# EAGLE design vds_topboard_revC (EAGLE 8.5.1)
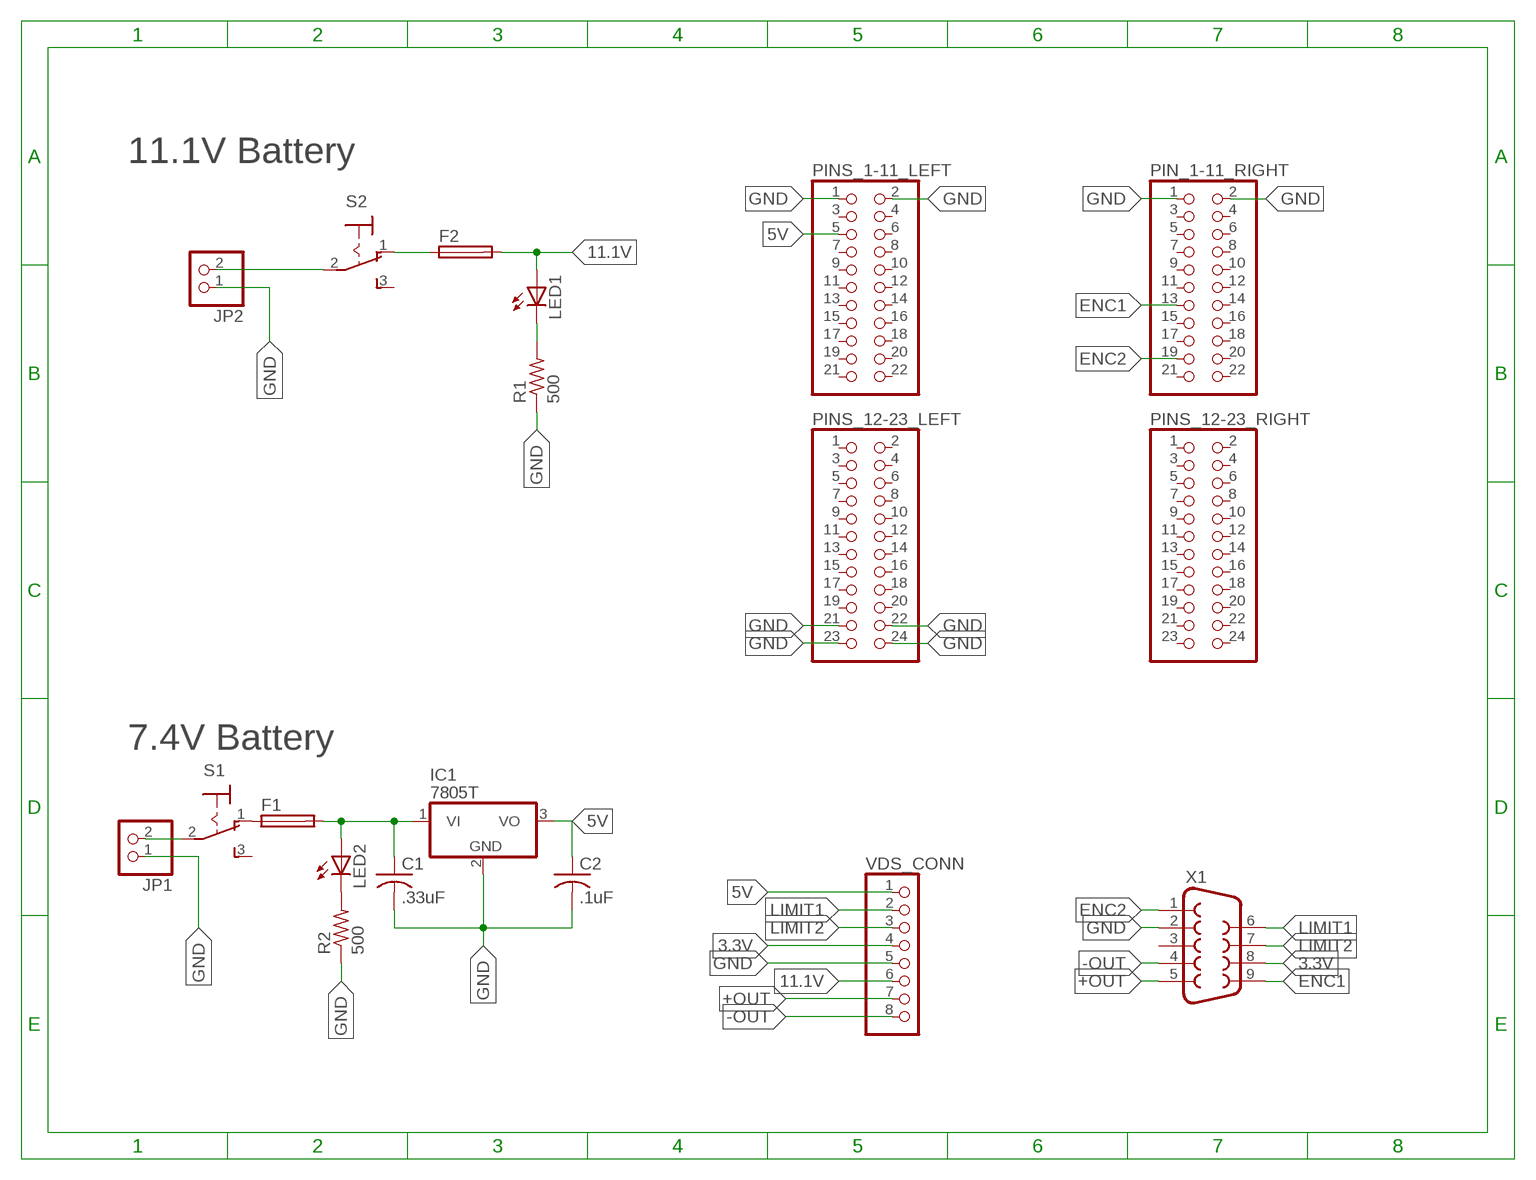
[diagram p0: schematic, sheet 1]

## Parts
C1  .33uF  C-US025-030X050  [C025-030X050]
C2  .1uF  C-US025-030X050  [C025-030X050]
F1  SH22,5  [SH22,5]
F2  SH22,5  [SH22,5]
IC1  7805T  [TO220H]
JP1  PINHD-1X2  [1X02]
JP2  PINHD-1X2  [1X02]
LED1  LED5MM  [LED5MM]
LED2  LED5MM  [LED5MM]
PIN_1-11_RIGHT  PINHD-2X11  [2X11]
PINS_1-11_LEFT  PINHD-2X11  [2X11]
PINS_12-23_LEFT  PINHD-2X12  [2X12]
PINS_12-23_RIGHT  PINHD-2X12  [2X12]
R1  500  R-US_0204/5  [0204/5]
R2  500  R-US_0204/5  [0204/5]
S1  320-916  [320-916]
S2  320-916  [320-916]
VDS_CONN  PINHD-1X8  [1X08]
X1  F09VP  [F09VP]

## Nets
3.3V: VDS_CONN.4 X1.8
5V: C2.1 IC1.3(VO) PINS_1-11_LEFT.5 VDS_CONN.1
7.4VO: C1.1 F1.2 IC1.1(VI) LED2.A
11.1V: F2.2 LED1.A VDS_CONN.6
+OUT: VDS_CONN.7 X1.5
-OUT: VDS_CONN.8 X1.4
ENC1: PIN_1-11_RIGHT.13 X1.9
ENC2: PIN_1-11_RIGHT.19 X1.1
GND: C1.2 C2.2 IC1.2(GND) JP1.1 JP2.1 PIN_1-11_RIGHT.1 PIN_1-11_RIGHT.2 PINS_1-11_LEFT.1 PINS_1-11_LEFT.2 PINS_12-23_LEFT.21 PINS_12-23_LEFT.22 PINS_12-23_LEFT.23 PINS_12-23_LEFT.24 R1.1 R2.1 VDS_CONN.5 X1.2
LIMIT1: VDS_CONN.2 X1.6
LIMIT2: VDS_CONN.3 X1.7
N$1: JP1.2 S1.2(P)
N$2: JP2.2 S2.2(P)
N$4: F2.1 S2.1(O)
N$5: LED1.K(C) R1.2
N$6: LED2.K(C) R2.2
N$7: F1.1 S1.1(O)
Unconnected: PIN_1-11_RIGHT.3 PIN_1-11_RIGHT.4 PIN_1-11_RIGHT.5 PIN_1-11_RIGHT.6 PIN_1-11_RIGHT.7 PIN_1-11_RIGHT.8 PIN_1-11_RIGHT.9 PIN_1-11_RIGHT.10 PIN_1-11_RIGHT.11 PIN_1-11_RIGHT.12 PIN_1-11_RIGHT.14 PIN_1-11_RIGHT.15 PIN_1-11_RIGHT.16 PIN_1-11_RIGHT.17 PIN_1-11_RIGHT.18 PIN_1-11_RIGHT.20 PIN_1-11_RIGHT.21 PIN_1-11_RIGHT.22 PINS_1-11_LEFT.3 PINS_1-11_LEFT.4 PINS_1-11_LEFT.6 PINS_1-11_LEFT.7 PINS_1-11_LEFT.8 PINS_1-11_LEFT.9 PINS_1-11_LEFT.10 PINS_1-11_LEFT.11 PINS_1-11_LEFT.12 PINS_1-11_LEFT.13 PINS_1-11_LEFT.14 PINS_1-11_LEFT.15 PINS_1-11_LEFT.16 PINS_1-11_LEFT.17 PINS_1-11_LEFT.18 PINS_1-11_LEFT.19 PINS_1-11_LEFT.20 PINS_1-11_LEFT.21 PINS_1-11_LEFT.22 PINS_12-23_LEFT.1 PINS_12-23_LEFT.2 PINS_12-23_LEFT.3 PINS_12-23_LEFT.4 PINS_12-23_LEFT.5 PINS_12-23_LEFT.6 PINS_12-23_LEFT.7 PINS_12-23_LEFT.8 PINS_12-23_LEFT.9 PINS_12-23_LEFT.10 PINS_12-23_LEFT.11 PINS_12-23_LEFT.12 PINS_12-23_LEFT.13 PINS_12-23_LEFT.14 PINS_12-23_LEFT.15 PINS_12-23_LEFT.16 PINS_12-23_LEFT.17 PINS_12-23_LEFT.18 PINS_12-23_LEFT.19 PINS_12-23_LEFT.20 PINS_12-23_RIGHT.1 PINS_12-23_RIGHT.2 PINS_12-23_RIGHT.3 PINS_12-23_RIGHT.4 PINS_12-23_RIGHT.5 PINS_12-23_RIGHT.6 PINS_12-23_RIGHT.7 PINS_12-23_RIGHT.8 PINS_12-23_RIGHT.9 PINS_12-23_RIGHT.10 PINS_12-23_RIGHT.11 PINS_12-23_RIGHT.12 PINS_12-23_RIGHT.13 PINS_12-23_RIGHT.14 PINS_12-23_RIGHT.15 PINS_12-23_RIGHT.16 PINS_12-23_RIGHT.17 PINS_12-23_RIGHT.18 PINS_12-23_RIGHT.19 PINS_12-23_RIGHT.20 PINS_12-23_RIGHT.21 PINS_12-23_RIGHT.22 PINS_12-23_RIGHT.23 PINS_12-23_RIGHT.24 S1.3(S) S2.3(S) X1.3

## Notes on the sheet
- 11.1V Battery
- 7.4V Battery

## Library data of the parts
C1 C2 = adafruit:C-US: CAPACITOR, American symbol
F1 F2 = fuse:SH22,5: FUSE HOLDER grid 22,5 mm, OGN0031 8201, Schurter (Buerklin); MF: SCHURTER; MPN: 0031.8201; OC_FARNELL: 1162740; OC_NEWARK: 96F8317
IC1 = linear:78*: Positive VOLTAGE REGULATOR Source: http://cache.national.com/ds/LM/LM78L05.pdf http://www.fairchildsemi.com/ds/LM/LM7805.pdf
JP1 JP2 = pinhead:PINHD-1X2: PIN HEADER
LED1 LED2 = adafruit:LED: LED OSRAM: - CHIPLED LG R971, LG N971, LY N971, LG Q971, LY Q971, LO R971, LY R971 LH N974, LH R974 LS Q976, LO Q976, LY Q976 LO Q996 - Hyper CHIPLED LW Q18S LB Q993, LB Q99A, LB R99A - SideLED LS A670, LO A670, LY A670, LG A670, LP A670 LB A673, LV A673, LT A673, LW A673 LH A674 LY A675 LS A676, LA A676, LO A676, LY A676, LW A676 LS A679, LY A679, LG A679 - Hyper Micro SIDELED® LS Y876, LA Y876, LO Y876, LY Y876 LT Y87S - SmartLED LW L88C, LW L88S LB L89C, LB L89S, LG L890 LS L89K, LO L89K, LY L89K LS L896, LA L896, LO L896, LY L896 - TOPLED LS T670, LO T670, LY T670, LG T670, LP T670 LSG T670, LSP T670, LSY T670, LOP T670, LYG T670 LG T671, LOG T671, LSG T671 LB T673, LV T673, LT T673, LW T673 LH T674 LS T676, LA T676, LO T676, LY T676, LB T676, LH T676, LSB T676, LW T676 LB T67C, LV T67C, LT T67C, LS T67K, LO T67K, LY T67K, LW E67C LS E67B, LA E67B, LO E67B, LY E67B, LB E67C, LV E67C, LT E67C LW T67C LS T679, LY T679, LG T679 LS T770, LO T770, LY T770, LG T770, LP T770 LB T773, LV T773, LT T773, LW T773 LH T774 LS E675, LA E675, LY E675, LS T675 LS T776, LA T776, LO T776, LY T776, LB T776 LHGB T686 LT T68C, LB T68C - Hyper Mini TOPLED® LB M676 - Mini TOPLED Santana® LG M470 LS M47K, LO M47K, LY M47K Source: http://www.osram.convergy.de/
PIN_1-11_RIGHT PINS_1-11_LEFT = pinhead:PINHD-2X11: PIN HEADER
PINS_12-23_LEFT PINS_12-23_RIGHT = pinhead:PINHD-2X12: PIN HEADER
R1 R2 = adafruit:R-US_: RESISTOR, American symbol
S1 S2 = switch:320-916: TOGGLE SWITCH distributor RS Components
VDS_CONN = pinhead:PINHD-1X8: PIN HEADER
X1 = con-subd:F09: SUB-D; OC_FARNELL: unknown; OC_NEWARK: unknown

## Board
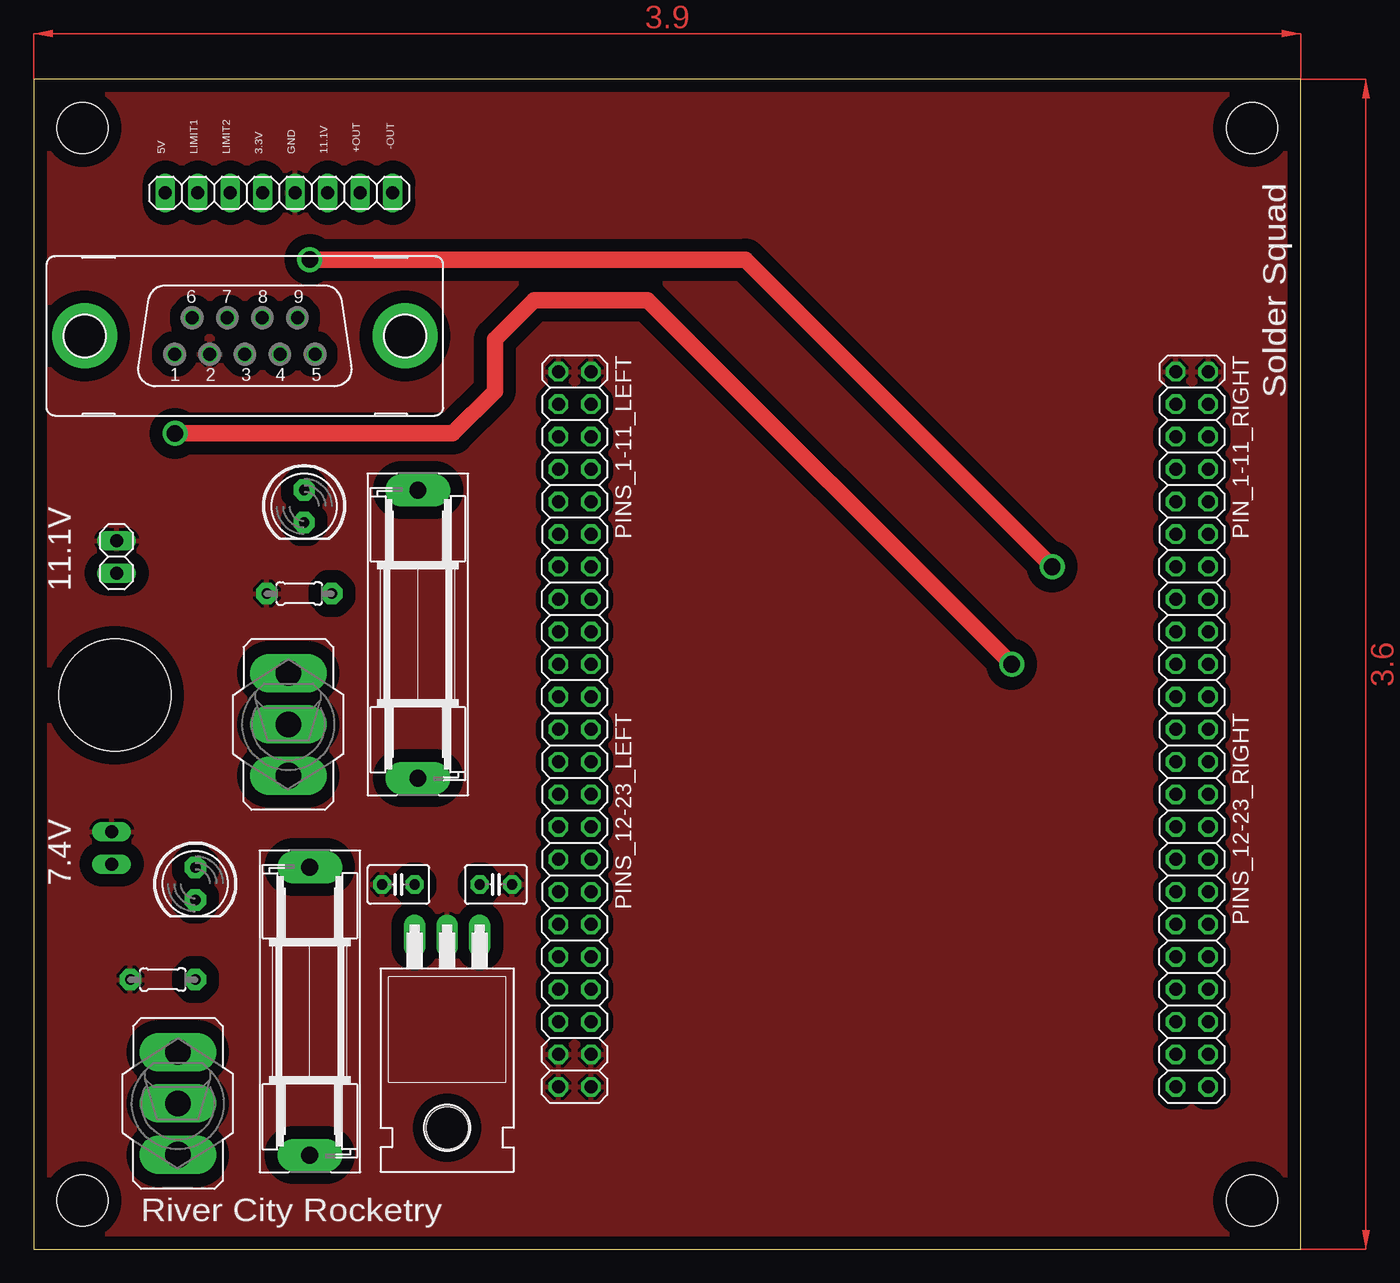
[diagram p1: board, top side]
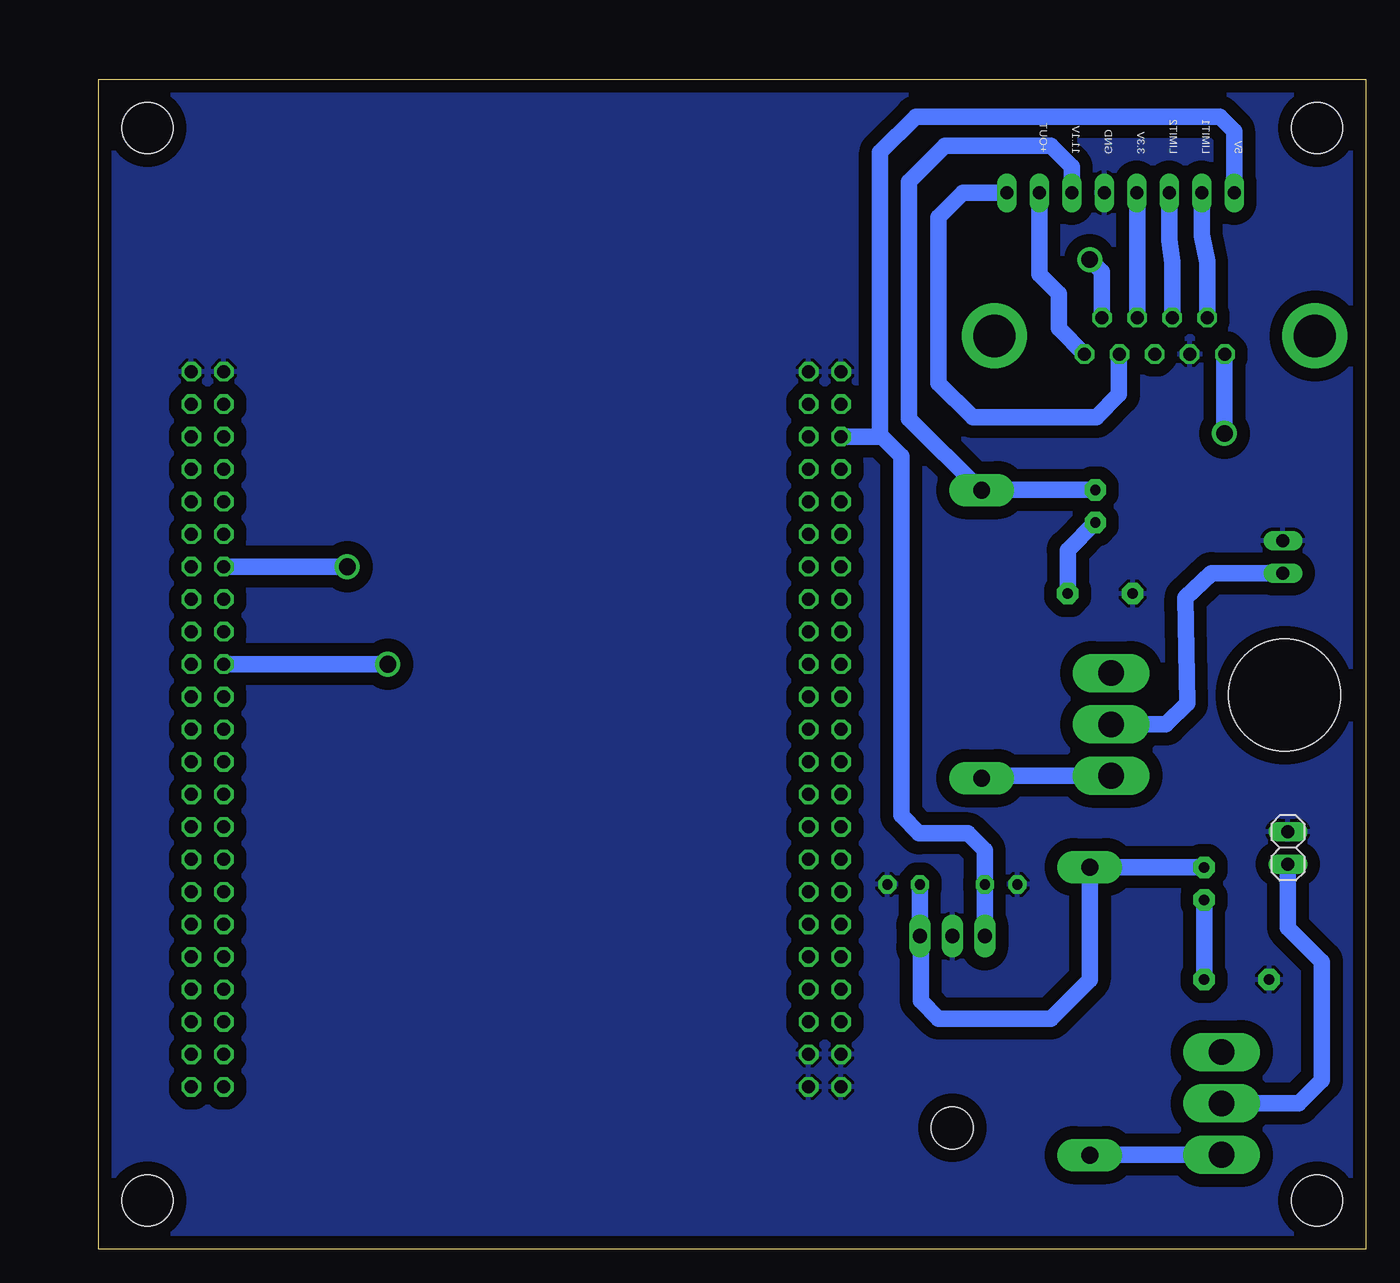
[diagram p2: board, bottom side, seen from below]

Size 99.06 x 91.44 mm. Coordinates in mm from the lower left corner, seen from the top.
Outline: 0,0 99.06,0 99.06,91.44 0,91.44 0,0
Copper layers (1*16): Top 0.035mm / dielectric 1.5mm / Bottom 0.035mm
Design rules "default *": minimum track width 10mil, minimum drill 24mil, track to track 1mm, track to pad 1mm, pad to pad 1mm, via to via 1mm, smd to smd 1mm, copper to edge 40mil, drill to drill 8mil, minimum pad ring 10mil, minimum via ring 8mil, stop-mask expansion 4mil, vias tented up to drill 0mil, thermal gap 10mil
Holes 4 mm at 3.81,3.81 3.81,87.63 95.25,87.63 95.25,3.81
Holes 8.76 mm at 6.35,43.31

### Footprints (pad centres in the part's own frame; a part is rotated, then mirrored left to right if it is on the bottom)
C025-030X050 = drill 0.813 pad 1.422 octagon: 1 -1.27,0; 2 1.27,0
SH22,5 = drill 1.321 pad 2.54 long: 1 -11.252,0; 2 11.252,0
TO220H = drill 1.118 long: 1 -2.54,-10.16; 2 0,-10.16; 3 2.54,-10.16 | hole 3.302: 0,4.826
1X02 = drill 1.016 long: 1 -1.27,0; 2 1.27,0
LED5MM = drill 0.813 pad 1.676 octagon: A -1.27,0; K 1.27,0
2X11 = drill 1.016 octagon: 1 -12.7,-1.27; 2 -12.7,1.27; 3 -10.16,-1.27; 4 -10.16,1.27; 5 -7.62,-1.27; 6 -7.62,1.27; 7 -5.08,-1.27; 8 -5.08,1.27; 9 -2.54,-1.27; 10 -2.54,1.27; 11 0,-1.27; 12 0,1.27; 13 2.54,-1.27; 14 2.54,1.27; 15 5.08,-1.27; 16 5.08,1.27; 17 7.62,-1.27; 18 7.62,1.27; 19 10.16,-1.27; 20 10.16,1.27; 21 12.7,-1.27; 22 12.7,1.27
2X12 = drill 1.016 octagon: 1 -13.97,-1.27; 2 -13.97,1.27; 3 -11.43,-1.27; 4 -11.43,1.27; 5 -8.89,-1.27; 6 -8.89,1.27; 7 -6.35,-1.27; 8 -6.35,1.27; 9 -3.81,-1.27; 10 -3.81,1.27; 11 -1.27,-1.27; 12 -1.27,1.27; 13 1.27,-1.27; 14 1.27,1.27; 15 3.81,-1.27; 16 3.81,1.27; 17 6.35,-1.27; 18 6.35,1.27; 19 8.89,-1.27; 20 8.89,1.27; 21 11.43,-1.27; 22 11.43,1.27; 23 13.97,-1.27; 24 13.97,1.27
0204/5 = drill 0.813 pad 1.676 octagon: 1 -2.54,0; 2 2.54,0
320-916 = drill 2.007 long: 1 0,4.013; 2 0,0; 3 0,-4.013
1X08 = drill 1.016 long: 1 -8.89,0; 2 -6.35,0; 3 -3.81,0; 4 -1.27,0; 5 1.27,0; 6 3.81,0; 7 6.35,0; 8 8.89,0
F09VP = drill 1.016 octagon: 1 5.486,1.422; 2 2.743,1.422; 3 0,1.422; 4 -2.743,1.422; 5 -5.486,1.422; 6 4.115,-1.422; 7 1.372,-1.422; 8 -1.372,-1.422; 9 -4.115,-1.422 | drill 3.302 pad 5.08: G1 -12.522,0; G2 12.522,0

### Placement (x,y rotation side)
C1  36.13,28.51 0 top
C2  28.51,28.51 180 top
F1  21.59,18.61 90 top
F2  30.04,48.07 90 top
IC1  32.32,14.32 180 top
JP1  6.1,31.37 270 bottom
JP2  6.48,54.1 270 top
LED1  21.15,58.07 270 top
LED2  12.64,28.57 270 top
PIN_1-11_RIGHT  90.55,55.88 270 top
PINS_1-11_LEFT  42.29,55.88 270 top
PINS_12-23_LEFT  42.29,26.67 270 top
PINS_12-23_RIGHT  90.55,26.67 270 top
R1  20.76,51.24 0 top
R2  10.1,21.08 0 top
S1  11.27,11.4 180 top
S2  19.91,41.02 180 top
VDS_CONN  19.18,82.55 0 top
X1  16.51,71.37 180 top

### Tracks (layer width: path | path; a pad name or v marks a point on that pad's centre or on a via)
3.3V
  Bottom 1.27: X1.8 17.88,82.53 VDS_CONN.4
5V
  Bottom 1.27: IC1.3 C2.1 29.78,31.18 31.11,32.51 34.92,32.51 36.32,33.91 36.32,61.98 37.85,63.5 | 37.85,63.5 PINS_1-11_LEFT.5 | VDS_CONN.1 10.29,87.38 11.43,88.52 35.18,88.52 37.97,85.72 37.97,63.63 37.85,63.5
7.4VO  (via drill 0.35)
  Bottom 1.27: C1.1 IC1.1 v34.8,24.42 34.8,19.43 33.4,18.03 24.64,18.03 21.59,21.08 F1.2 21.58,29.84 LED2.A
11.1V
  Bottom 1.27: LED1.A 30.02,59.34 F2.2 30.11,59.32 35.7,64.91 35.7,83.42 32.89,86.23 24.64,86.23 22.99,84.58 VDS_CONN.6
+OUT
  Bottom 1.27: X1.5 24,71.96 24,74.68 25.53,76.2 VDS_CONN.7
-OUT
  Bottom 1.27: X1.4 19.3,69.9 19.3,66.8 21.08,65.02 30.73,65.02 33.4,67.69 33.4,80.64 31.5,82.55 VDS_CONN.8
ENC1  (via drill 1.3 pad 1.95)
  Top 1.27: v21.59,77.34 55.63,77.34 v79.63,53.34
  Bottom 1.27: X1.9 20.62,76.38 v21.59,77.34 | v79.63,53.34 PIN_1-11_RIGHT.13
ENC2  (via drill 1.3 pad 1.95)
  Top 1.27: v11.05,63.75 32.77,63.75 36.07,67.06 36.07,71.12 39.12,74.17 48.01,74.17 v76.45,45.72
  Bottom 1.27: 10.95,69.95 X1.1 11.05,69.93 v11.05,63.75 | v76.45,45.72 PIN_1-11_RIGHT.19
GND
  pour Top: 0,91.44 0,0 99.06,0 99.06,91.44
  pour Bottom: 0,91.44 0,0 99.06,0 99.06,91.44
LIMIT1
  Bottom 1.27: X1.6 12.39,77.17 12.83,79.25 VDS_CONN.2
LIMIT2
  Bottom 1.27: X1.7 15.14,77.11 15.37,78.87 VDS_CONN.3
N$1
  Bottom 1.27: S1.2 5.24,11.4 3.43,13.21 3.43,22.48 6.1,25.15 JP1.2
N$2
  Bottom 1.27: S2.2 15.62,41.02 13.97,42.67 14.1,50.93 12.06,52.83 JP2.2
N$4
  Bottom 1.27: S2.1 29.84,37.01 F2.1
N$5
  Bottom 1.27: LED1.K 23.3,54.64 R1.2
N$6
  Bottom 1.27: R2.2 LED2.K
N$7
  Bottom 1.27: S1.1 21.56,7.38 F1.1
(copper drawn outside any net)
  shapes: Top area x2

### Text on the board
tPlace: 5V | LIMIT1 | LIMIT2 | 3.3V | GND | 11.1V | +OUT | -OUT | Solder Squad | 11.1V | 7.4V | River City Rocketry
bPlace: 5V | LIMIT1 | LIMIT2 | 3.3V | GND | 11.1V | +OUT